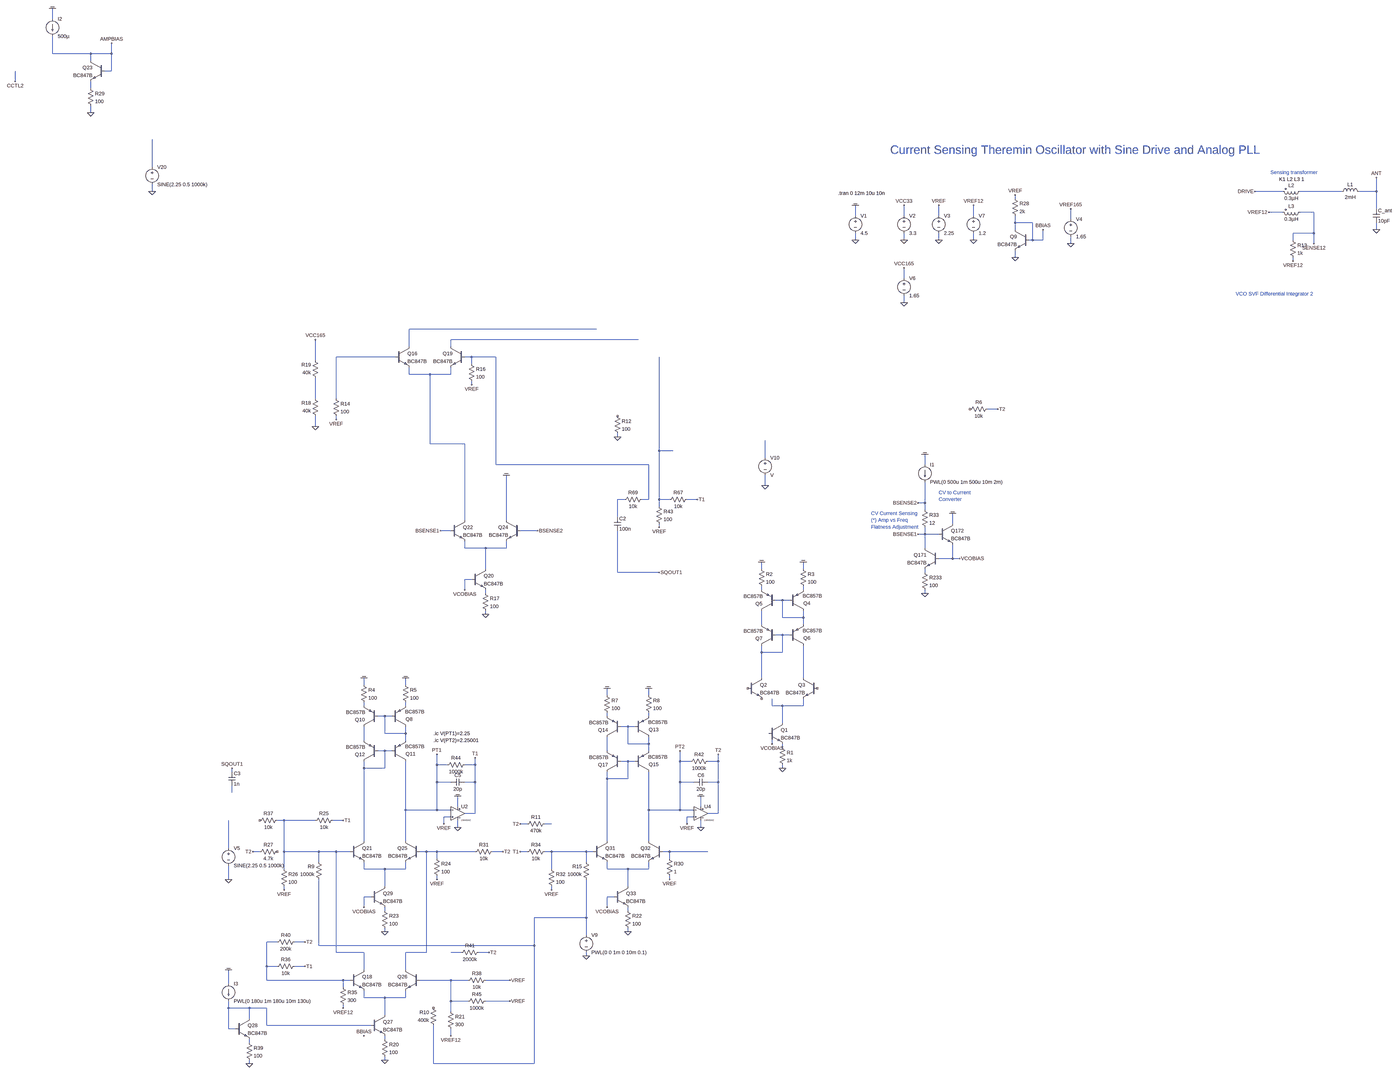
[diagram p0: schematic theremin_oscillator_bjt_v02.asc, whole sheet]
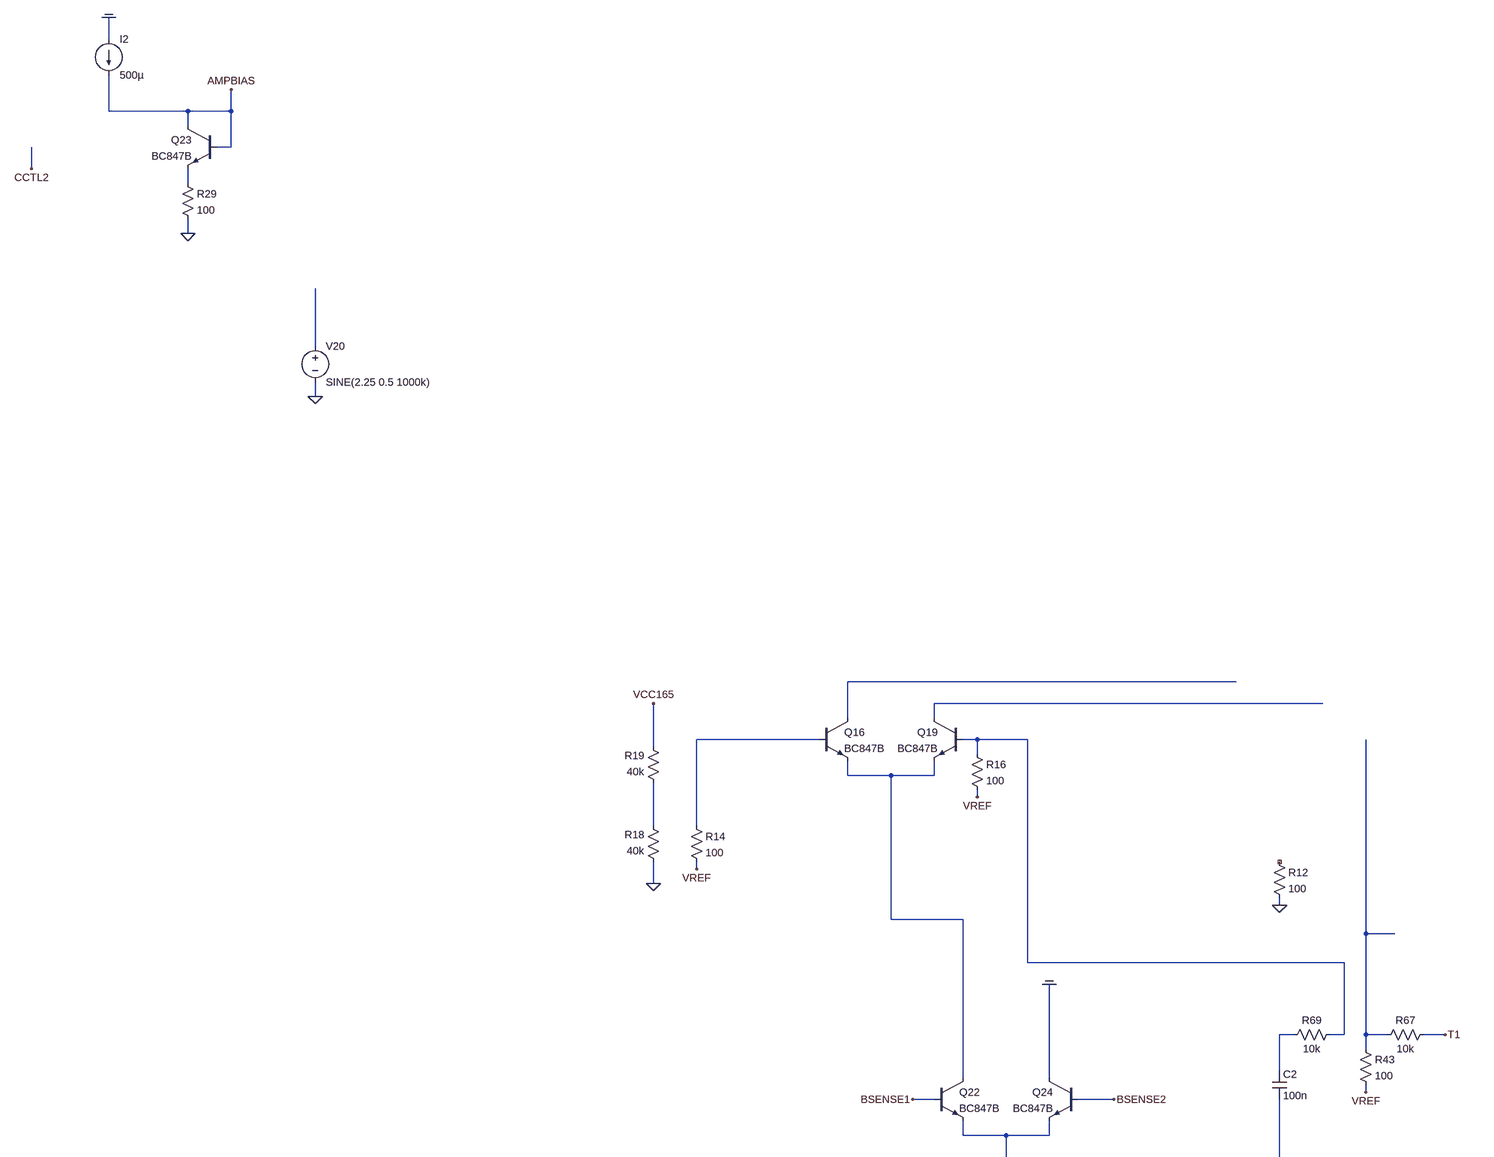
[diagram p1: schematic theremin_oscillator_bjt_v02.asc, part, row 1 of 2, column 1 of 2]
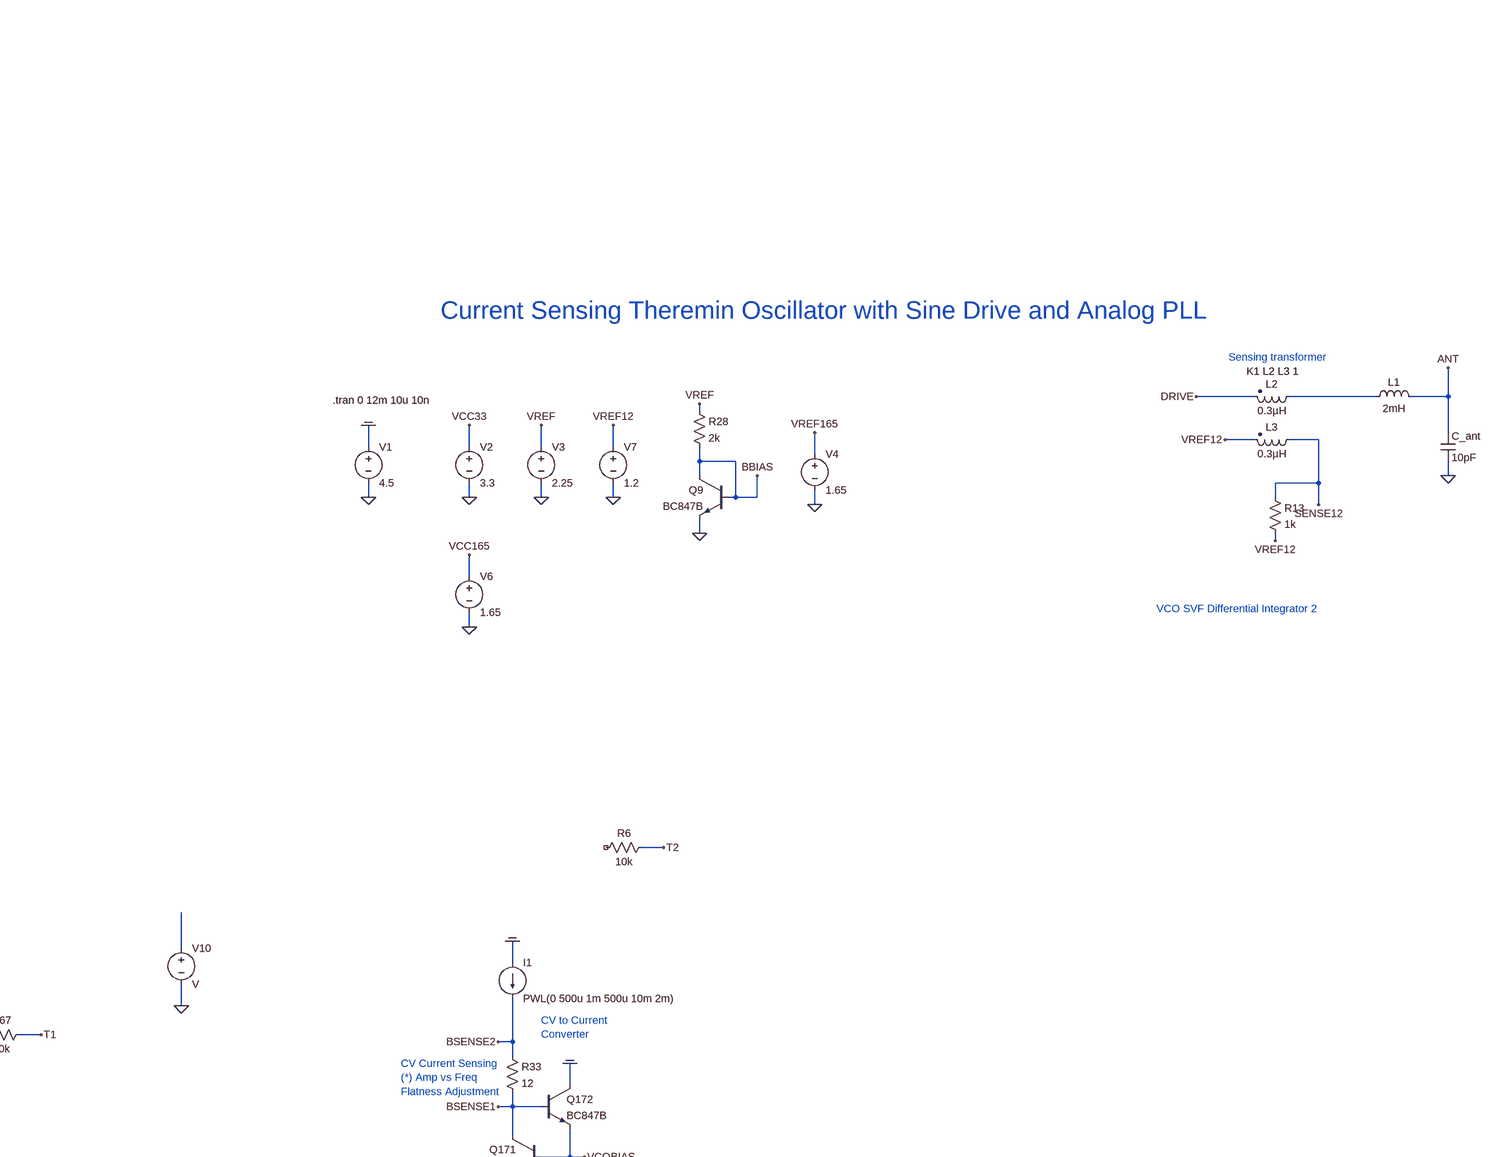
[diagram p2: schematic theremin_oscillator_bjt_v02.asc, part, row 1 of 2, column 2 of 2]
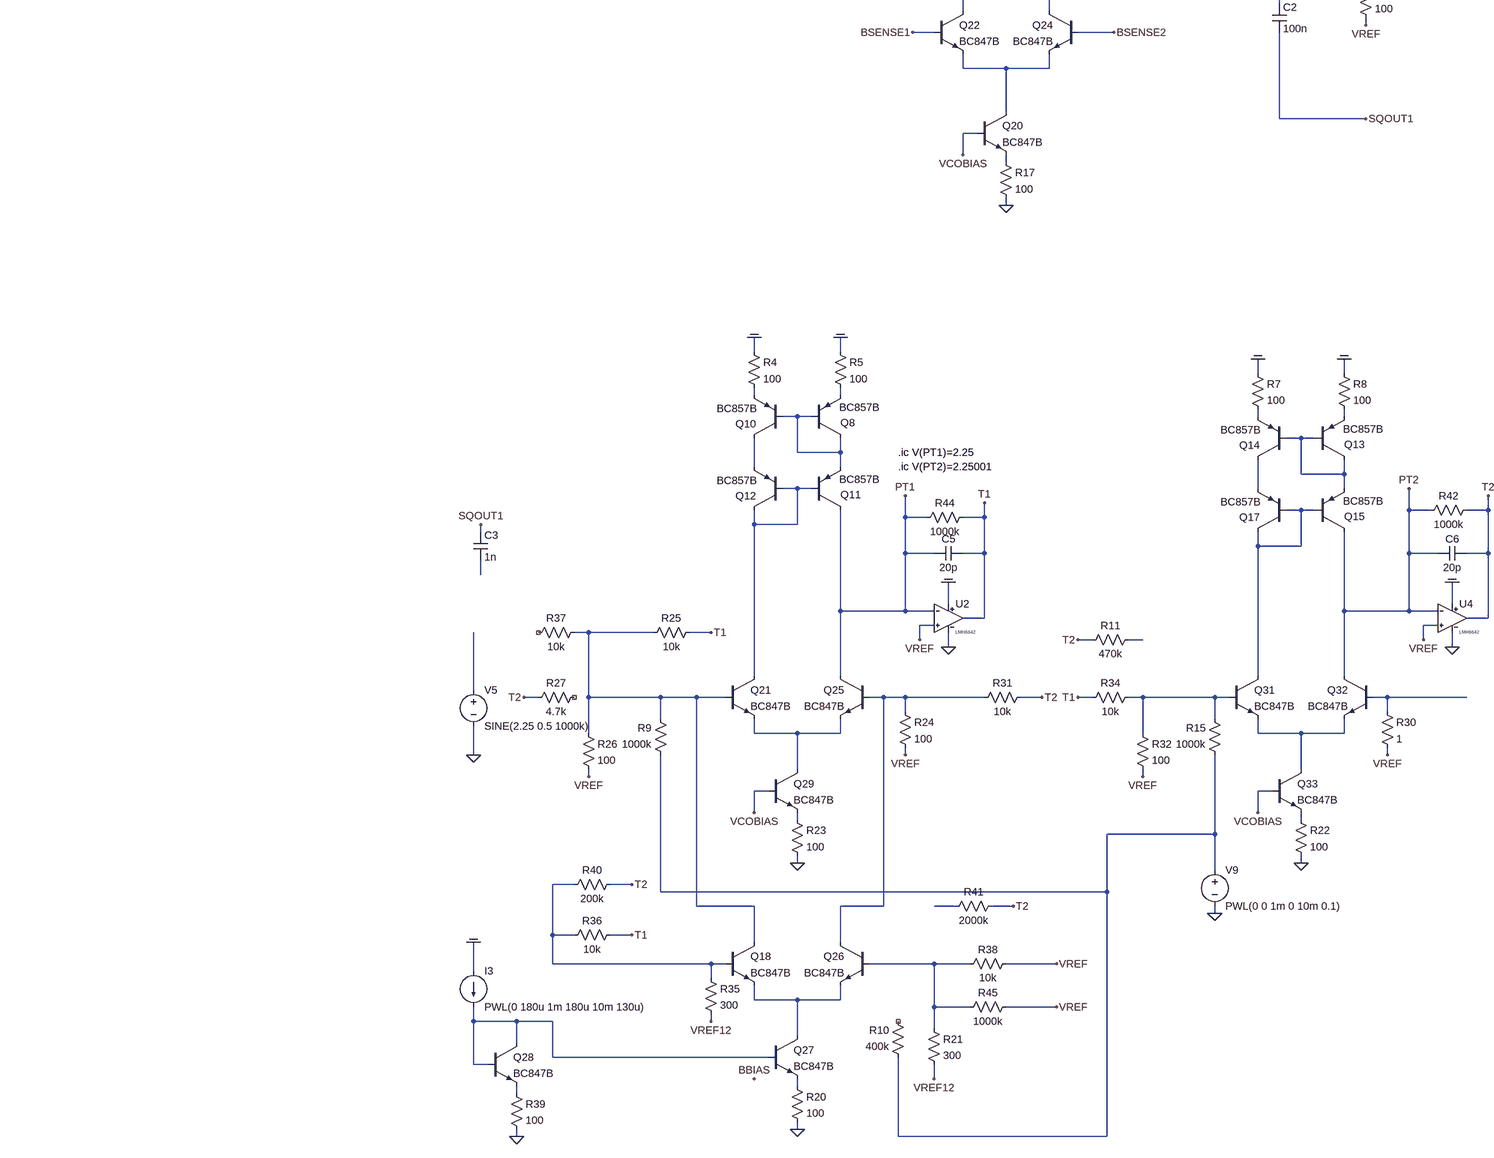
[diagram p3: schematic theremin_oscillator_bjt_v02.asc, part, row 2 of 2, column 1 of 2]
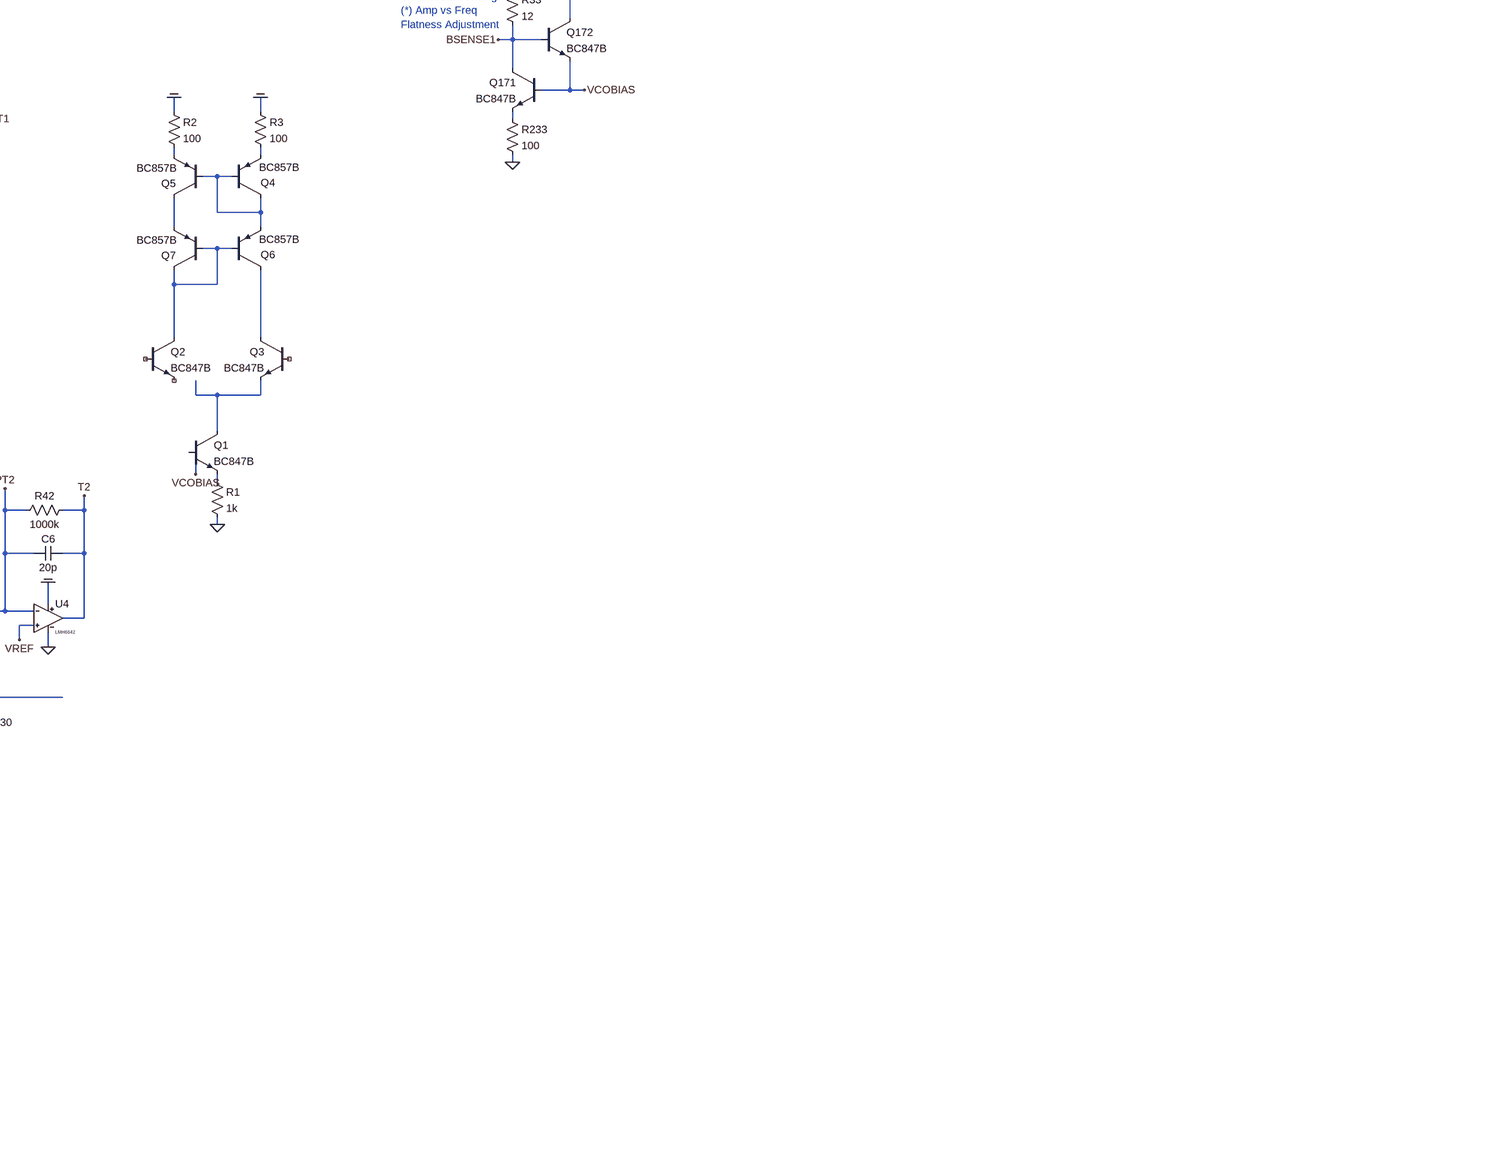
[diagram p4: schematic theremin_oscillator_bjt_v02.asc, part, row 2 of 2, column 2 of 2]
theremin_oscillator_bjt_v02.asc, the LTspice schematic file:
Version 4
SHEET 1 17540 12720
WIRE -192 2960 -192 2912
WIRE -192 3120 -192 3040
WIRE -16 3120 -192 3120
WIRE 80 3120 80 3072
WIRE 80 3120 -16 3120
WIRE -16 3152 -16 3120
WIRE 80 3200 80 3120
WIRE 80 3200 48 3200
WIRE -432 3248 -432 3200
WIRE -16 3280 -16 3248
WIRE -16 3392 -16 3360
WIRE 592 3664 592 3536
WIRE 592 3776 592 3744
WIRE 5840 3776 5712 3776
WIRE 6112 3776 5920 3776
WIRE 6272 3776 6272 3712
WIRE 6272 3776 6192 3776
WIRE 4608 3808 4608 3792
WIRE 6272 3856 6272 3776
WIRE 5840 3872 5776 3872
WIRE 5984 3872 5920 3872
WIRE 3872 3888 3872 3840
WIRE 4096 3888 4096 3840
WIRE 4256 3888 4256 3840
WIRE 4416 3888 4416 3840
WIRE 4864 3904 4864 3856
WIRE 4608 3920 4608 3888
WIRE 4688 3920 4608 3920
WIRE 4608 3952 4608 3920
WIRE 6272 3952 6272 3920
WIRE 5984 3968 5984 3872
WIRE 5984 3968 5888 3968
WIRE 3872 4000 3872 3968
WIRE 4096 4000 4096 3968
WIRE 4256 4000 4256 3968
WIRE 4416 4000 4416 3968
WIRE 4688 4000 4688 3920
WIRE 4688 4000 4672 4000
WIRE 4736 4000 4736 3952
WIRE 4736 4000 4688 4000
WIRE 5888 4000 5888 3968
WIRE 4864 4016 4864 3984
WIRE 5984 4016 5984 3968
WIRE 4608 4080 4608 4048
WIRE 5888 4096 5888 4080
WIRE 4096 4176 4096 4128
WIRE 4096 4288 4096 4256
WIRE 2640 5152 1776 5152
WIRE 2832 5200 1968 5200
WIRE 1776 5232 1776 5152
WIRE 1968 5232 1968 5200
WIRE 1712 5280 1440 5280
WIRE 2064 5280 2032 5280
WIRE 2176 5280 2064 5280
WIRE 1344 5296 1344 5200
WIRE 2064 5312 2064 5280
WIRE 1776 5360 1776 5328
WIRE 1872 5360 1776 5360
WIRE 1968 5360 1968 5328
WIRE 1968 5360 1872 5360
WIRE 2064 5408 2064 5392
WIRE 1344 5472 1344 5376
WIRE 1440 5472 1440 5280
WIRE 4528 5520 4480 5520
WIRE 1440 5568 1440 5552
WIRE 1344 5600 1344 5552
WIRE 2736 5648 2736 5632
WIRE 1872 5680 1872 5360
WIRE 2032 5680 1872 5680
WIRE 2928 5712 2928 5280
WIRE 2992 5712 2928 5712
WIRE 3456 5744 3456 5664
WIRE 2176 5776 2176 5280
WIRE 2880 5776 2176 5776
WIRE 4192 5776 4192 5728
WIRE 3456 5872 3456 5824
WIRE 2768 5936 2736 5936
WIRE 2880 5936 2880 5776
WIRE 2880 5936 2848 5936
WIRE 2928 5936 2928 5712
WIRE 2976 5936 2928 5936
WIRE 3104 5936 3056 5936
WIRE 4192 5952 4192 5856
WIRE 4192 5952 4160 5952
WIRE 2928 5968 2928 5936
WIRE 4192 5984 4192 5952
WIRE 2736 6016 2736 5936
WIRE 2032 6032 2032 5680
WIRE 2224 6032 2224 5824
WIRE 4320 6048 4320 6000
WIRE 2928 6064 2928 6048
WIRE 1968 6080 1920 6080
WIRE 2368 6080 2288 6080
WIRE 4192 6096 4192 6064
WIRE 4192 6096 4160 6096
WIRE 4256 6096 4192 6096
WIRE 2032 6160 2032 6128
WIRE 2128 6160 2032 6160
WIRE 2224 6160 2224 6128
WIRE 2224 6160 2128 6160
WIRE 4192 6160 4192 6096
WIRE 4320 6208 4320 6144
WIRE 4320 6208 4256 6208
WIRE 4352 6208 4320 6208
WIRE 2128 6256 2128 6160
WIRE 3440 6256 3440 6224
WIRE 3632 6256 3632 6224
WIRE 2736 6272 2736 6080
WIRE 2928 6272 2736 6272
WIRE 4192 6272 4192 6256
WIRE 2064 6304 2032 6304
WIRE 2032 6352 2032 6304
WIRE 3440 6352 3440 6336
WIRE 3632 6352 3632 6336
WIRE 2128 6368 2128 6352
WIRE 4192 6368 4192 6352
WIRE 3536 6400 3504 6400
WIRE 3568 6400 3536 6400
WIRE 2128 6464 2128 6448
WIRE 3536 6480 3536 6400
WIRE 3632 6480 3632 6448
WIRE 3632 6480 3536 6480
WIRE 3440 6512 3440 6448
WIRE 3632 6512 3632 6480
WIRE 3536 6560 3504 6560
WIRE 3568 6560 3536 6560
WIRE 3440 6640 3440 6608
WIRE 3536 6640 3536 6560
WIRE 3536 6640 3440 6640
WIRE 3440 6816 3440 6640
WIRE 3632 6816 3632 6608
WIRE 1568 6848 1568 6816
WIRE 1760 6848 1760 6816
WIRE 2688 6896 2688 6864
WIRE 2880 6896 2880 6864
WIRE 1568 6944 1568 6928
WIRE 1760 6944 1760 6928
WIRE 3488 6944 3488 6912
WIRE 3536 6944 3488 6944
WIRE 3632 6944 3632 6912
WIRE 3632 6944 3536 6944
WIRE 1664 6992 1632 6992
WIRE 1696 6992 1664 6992
WIRE 2688 6992 2688 6976
WIRE 2880 6992 2880 6976
WIRE 3536 7024 3536 6944
WIRE 2784 7040 2752 7040
WIRE 2816 7040 2784 7040
WIRE 1664 7072 1664 6992
WIRE 1760 7072 1760 7040
WIRE 1760 7072 1664 7072
WIRE 3488 7072 3472 7072
WIRE 1568 7104 1568 7040
WIRE 1760 7104 1760 7072
WIRE 2784 7120 2784 7040
WIRE 2880 7120 2880 7088
WIRE 2880 7120 2784 7120
WIRE 3488 7120 3488 7072
WIRE 3536 7136 3536 7120
WIRE 1664 7152 1632 7152
WIRE 1696 7152 1664 7152
WIRE 2688 7152 2688 7088
WIRE 2880 7152 2880 7120
WIRE 2784 7200 2752 7200
WIRE 2816 7200 2784 7200
WIRE 3024 7200 3024 7152
WIRE 3072 7200 3024 7200
WIRE 3200 7200 3200 7168
WIRE 3200 7200 3152 7200
WIRE 1904 7216 1904 7168
WIRE 1952 7216 1904 7216
WIRE 2080 7216 2080 7184
WIRE 2080 7216 2032 7216
WIRE 1568 7232 1568 7200
WIRE 1664 7232 1664 7152
WIRE 1664 7232 1568 7232
WIRE 3536 7232 3536 7216
WIRE 960 7248 960 7232
WIRE 2688 7280 2688 7248
WIRE 2784 7280 2784 7200
WIRE 2784 7280 2688 7280
WIRE 1904 7296 1904 7216
WIRE 1968 7296 1904 7296
WIRE 2080 7296 2080 7216
WIRE 2080 7296 2032 7296
WIRE 3024 7296 3024 7200
WIRE 3088 7296 3024 7296
WIRE 3200 7296 3200 7200
WIRE 3200 7296 3152 7296
WIRE 960 7344 960 7312
WIRE 2000 7408 2000 7360
WIRE 3120 7408 3120 7360
WIRE 1760 7424 1760 7200
WIRE 1904 7424 1904 7296
WIRE 1904 7424 1760 7424
WIRE 1968 7424 1904 7424
WIRE 2880 7424 2880 7248
WIRE 3024 7424 3024 7296
WIRE 3024 7424 2880 7424
WIRE 3088 7424 3024 7424
WIRE 2080 7440 2080 7296
WIRE 2080 7440 2032 7440
WIRE 3200 7440 3200 7296
WIRE 3200 7440 3152 7440
WIRE 1968 7456 1936 7456
WIRE 3088 7456 3056 7456
WIRE 1200 7472 1168 7472
WIRE 1344 7472 1200 7472
WIRE 1472 7472 1424 7472
WIRE 1936 7488 1936 7456
WIRE 2320 7488 2288 7488
WIRE 2432 7488 2400 7488
WIRE 3056 7488 3056 7456
WIRE 2000 7504 2000 7472
WIRE 3120 7504 3120 7472
WIRE 1568 7568 1568 7232
WIRE 1760 7568 1760 7424
WIRE 2688 7568 2688 7280
WIRE 2880 7568 2880 7424
WIRE 944 7600 944 7472
WIRE 1088 7616 1056 7616
WIRE 1200 7616 1200 7472
WIRE 1360 7616 1200 7616
WIRE 1440 7616 1360 7616
WIRE 1504 7616 1440 7616
WIRE 1856 7616 1824 7616
WIRE 1904 7616 1856 7616
WIRE 2080 7616 1904 7616
WIRE 2208 7616 2160 7616
WIRE 2320 7616 2288 7616
WIRE 2432 7616 2400 7616
WIRE 2592 7616 2432 7616
WIRE 2624 7616 2592 7616
WIRE 2976 7616 2944 7616
WIRE 3152 7616 2976 7616
WIRE 1904 7648 1904 7616
WIRE 2976 7648 2976 7616
WIRE 1360 7664 1360 7616
WIRE 2592 7664 2592 7616
WIRE 1200 7696 1200 7616
WIRE 1568 7696 1568 7664
WIRE 1664 7696 1568 7696
WIRE 1760 7696 1760 7664
WIRE 1760 7696 1664 7696
WIRE 2432 7696 2432 7616
WIRE 2688 7696 2688 7664
WIRE 2784 7696 2688 7696
WIRE 2880 7696 2880 7664
WIRE 2880 7696 2784 7696
WIRE 944 7744 944 7680
WIRE 1904 7744 1904 7728
WIRE 2976 7744 2976 7728
WIRE 1664 7776 1664 7696
WIRE 2784 7776 2784 7696
WIRE 1200 7792 1200 7776
WIRE 2432 7792 2432 7776
WIRE 1600 7824 1568 7824
WIRE 2720 7824 2688 7824
WIRE 1568 7872 1568 7824
WIRE 2688 7872 2688 7824
WIRE 1664 7888 1664 7872
WIRE 2784 7888 2784 7872
WIRE 2592 7920 2592 7744
WIRE 2592 7920 2352 7920
WIRE 1664 7984 1664 7968
WIRE 2784 7984 2784 7968
WIRE 2592 8000 2592 7920
WIRE 1168 8032 1120 8032
WIRE 1296 8032 1248 8032
WIRE 1360 8048 1360 7744
WIRE 2352 8048 2352 7920
WIRE 2352 8048 1360 8048
WIRE 1440 8080 1440 7616
WIRE 1568 8080 1440 8080
WIRE 1856 8080 1856 7616
WIRE 1856 8080 1760 8080
WIRE 2016 8080 1968 8080
WIRE 2144 8080 2096 8080
WIRE 2592 8096 2592 8080
WIRE 1120 8144 1120 8032
WIRE 1168 8144 1120 8144
WIRE 1296 8144 1248 8144
WIRE 1568 8160 1568 8080
WIRE 1760 8160 1760 8080
WIRE 1120 8208 1120 8144
WIRE 1472 8208 1120 8208
WIRE 1504 8208 1472 8208
WIRE 1968 8208 1824 8208
WIRE 2048 8208 1968 8208
WIRE 2240 8208 2128 8208
WIRE 944 8224 944 8160
WIRE 1472 8240 1472 8208
WIRE 1568 8288 1568 8256
WIRE 1664 8288 1568 8288
WIRE 1760 8288 1760 8256
WIRE 1760 8288 1664 8288
WIRE 1968 8304 1968 8208
WIRE 2048 8304 1968 8304
WIRE 2240 8304 2128 8304
WIRE 944 8336 944 8304
WIRE 1040 8336 944 8336
WIRE 1120 8336 1040 8336
WIRE 1472 8336 1472 8320
WIRE 1968 8352 1968 8304
WIRE 1664 8368 1664 8288
WIRE 1040 8384 1040 8336
WIRE 1120 8416 1120 8336
WIRE 1600 8416 1120 8416
WIRE 944 8432 944 8336
WIRE 976 8432 944 8432
WIRE 1968 8464 1968 8432
WIRE 1664 8480 1664 8464
WIRE 1040 8496 1040 8480
WIRE 1664 8576 1664 8560
WIRE 1040 8592 1040 8576
WIRE 1888 8592 1888 8416
WIRE 2352 8592 2352 8048
WIRE 2352 8592 1888 8592
FLAG 3872 4000 0
FLAG 3872 3840 COM
FLAG 4096 4000 0
FLAG 4096 3840 VCC33
FLAG 4256 4000 0
FLAG 4256 3840 VREF
FLAG 6272 3712 ANT
FLAG 6272 3952 0
FLAG 5712 3776 DRIVE
FLAG 4416 4000 0
FLAG 4416 3840 VREF12
FLAG 5776 3872 VREF12
FLAG 5984 4016 SENSE12
FLAG 5888 4096 VREF12
FLAG -432 3248 CCTL2
FLAG 592 3776 0
FLAG 4192 6368 0
FLAG 4320 6000 COM
FLAG 4352 6208 VCOBIAS
FLAG -16 3392 0
FLAG -192 2912 COM
FLAG 80 3072 AMPBIAS
FLAG 4160 6096 BSENSE1
FLAG 4160 5952 BSENSE2
FLAG 4608 4080 0
FLAG 4736 3952 BBIAS
FLAG 4608 3792 VREF
FLAG 4864 4016 0
FLAG 4864 3856 VREF165
FLAG 2928 6064 VREF
FLAG 3104 5936 T1
FLAG 4192 5728 COM
FLAG 3536 7232 0
FLAG 3488 7120 VCOBIAS
FLAG 3440 6224 COM
FLAG 3632 6224 COM
FLAG 4096 4288 0
FLAG 4096 4128 VCC165
FLAG 4528 5520 T2
FLAG 2928 6272 SQOUT1
FLAG 1440 5568 VREF
FLAG 2064 5408 VREF
FLAG 2128 6464 0
FLAG 2032 6352 VCOBIAS
FLAG 1920 6080 BSENSE1
FLAG 2368 6080 BSENSE2
FLAG 2736 5648 0
FLAG 2224 5824 COM
FLAG 1344 5200 VCC165
FLAG 1344 5600 0
FLAG 1664 7984 0
FLAG 1568 7872 VCOBIAS
FLAG 2000 7504 0
FLAG 2000 7360 COM
FLAG 1936 7488 VREF
FLAG 1904 7744 VREF
FLAG 1472 7472 T1
FLAG 1200 7792 VREF
FLAG 1056 7616 T2
FLAG 2784 7984 0
FLAG 2688 7872 VCOBIAS
FLAG 3120 7504 0
FLAG 3120 7360 COM
FLAG 3056 7488 VREF
FLAG 2976 7744 VREF
FLAG 2432 7792 VREF
FLAG 2288 7616 T1
FLAG 944 7744 0
FLAG 2080 7184 T1
FLAG 3200 7168 T2
FLAG 2208 7616 T2
FLAG 960 7232 SQOUT1
FLAG 1664 8576 0
FLAG 1568 8464 BBIAS
FLAG 1968 8464 VREF12
FLAG 1472 8336 VREF12
FLAG 1296 8144 T1
FLAG 1040 8592 0
FLAG 944 8160 COM
FLAG 2240 8208 VREF
FLAG 1904 7168 PT1
FLAG 3024 7152 PT2
FLAG 2592 8096 0
FLAG 3456 5872 0
FLAG 2288 7488 T2
FLAG 1296 8032 T2
FLAG 2144 8080 T2
FLAG 1568 6816 COM
FLAG 1760 6816 COM
FLAG 2688 6864 COM
FLAG 2880 6864 COM
FLAG 2240 8304 VREF
SYMBOL voltage 3872 3872 R0
SYMATTR InstName V1
SYMATTR Value 4.5
SYMBOL voltage 4096 3872 R0
SYMATTR InstName V2
SYMATTR Value 3.3
SYMBOL voltage 4256 3872 R0
SYMATTR InstName V3
SYMATTR Value 2.25
SYMBOL ind 6096 3792 R270
WINDOW 0 32 56 VTop 2
WINDOW 3 5 56 VBottom 2
SYMATTR InstName L1
SYMATTR Value 2mH
SYMATTR SpiceLine Rser=120 Cpar=1pF
SYMBOL Cap 6256 3856 R0
SYMATTR InstName C_ant
SYMATTR Value 10pF
SYMBOL voltage 4416 3872 R0
SYMATTR InstName V7
SYMATTR Value 1.2
SYMBOL ind2 5936 3760 R90
WINDOW 0 4 56 VBottom 2
WINDOW 3 32 56 VTop 2
SYMATTR InstName L2
SYMATTR Value 0.3µH
SYMATTR SpiceLine Rser=0.1 Cpar=0.1p
SYMBOL ind2 5936 3856 R90
WINDOW 0 4 56 VBottom 2
WINDOW 3 32 56 VTop 2
SYMATTR InstName L3
SYMATTR Value 0.3µH
SYMATTR SpiceLine Rser=0.1 Cpar=0.1p
SYMBOL Res 5872 3984 R0
SYMATTR InstName R13
SYMATTR Value 1k
SYMBOL Voltage 592 3648 R0
SYMATTR InstName V20
SYMATTR Value SINE(2.25 0.5 1000k)
SYMBOL Res 4176 6256 R0
SYMATTR InstName R233
SYMATTR Value 100
SYMBOL npn 4256 6160 M0
SYMATTR InstName Q171
SYMATTR Value BC847B
SYMBOL npn 4256 6048 R0
SYMATTR InstName Q172
SYMATTR Value BC847B
SYMBOL npn 48 3152 M0
SYMATTR InstName Q23
SYMATTR Value BC847B
SYMBOL Res -32 3264 R0
SYMATTR InstName R29
SYMATTR Value 100
SYMBOL current -192 2960 R0
SYMATTR InstName I2
SYMATTR Value 500µ
SYMBOL Res 4176 5968 R0
SYMATTR InstName R33
SYMATTR Value 12
SYMBOL npn 4672 3952 M0
SYMATTR InstName Q9
SYMATTR Value BC847B
SYMBOL Res 4592 3792 R0
SYMATTR InstName R28
SYMATTR Value 2k
SYMBOL voltage 4864 3888 R0
SYMATTR InstName V4
SYMATTR Value 1.65
SYMBOL Res 2912 5952 R0
SYMATTR InstName R43
SYMATTR Value 100
SYMBOL Res 3072 5920 R90
WINDOW 0 0 56 VBottom 2
WINDOW 3 32 56 VTop 2
SYMATTR InstName R67
SYMATTR Value 10k
SYMBOL Res 2864 5920 R90
WINDOW 0 0 56 VBottom 2
WINDOW 3 32 56 VTop 2
SYMATTR InstName R69
SYMATTR Value 10k
SYMBOL current 4192 5776 R0
SYMATTR InstName I1
SYMATTR Value PWL(0 500u 1m 500u 10m 2m)
SYMBOL Res 3520 7120 R0
SYMATTR InstName R1
SYMATTR Value 1k
SYMBOL npn 3472 7024 R0
SYMATTR InstName Q1
SYMATTR Value BC847B
SYMBOL npn 3376 6816 R0
SYMATTR InstName Q2
SYMATTR Value BC847B
SYMBOL npn 3696 6816 M0
SYMATTR InstName Q3
SYMATTR Value BC847B
SYMBOL pnp 3568 6448 M180
WINDOW 0 64 34 Left 2
WINDOW 3 61 68 Left 2
SYMATTR InstName Q4
SYMATTR Value BC857B
SYMBOL pnp 3504 6448 R180
WINDOW 0 60 32 Left 2
WINDOW 3 58 66 Left 2
SYMATTR InstName Q5
SYMATTR Value BC857B
SYMBOL Res 3424 6240 R0
SYMATTR InstName R2
SYMATTR Value 100
SYMBOL Res 3616 6240 R0
SYMATTR InstName R3
SYMATTR Value 100
SYMBOL pnp 3568 6608 M180
WINDOW 0 64 34 Left 2
WINDOW 3 61 68 Left 2
SYMATTR InstName Q6
SYMATTR Value BC857B
SYMBOL pnp 3504 6608 R180
WINDOW 0 60 32 Left 2
WINDOW 3 58 66 Left 2
SYMATTR InstName Q7
SYMATTR Value BC857B
SYMBOL voltage 4096 4160 R0
SYMATTR InstName V6
SYMATTR Value 1.65
SYMBOL Res 4496 5504 R90
WINDOW 0 0 56 VBottom 2
WINDOW 3 32 56 VTop 2
SYMATTR InstName R6
SYMATTR Value 10k
SYMBOL npn 1712 5232 R0
SYMATTR InstName Q16
SYMATTR Value BC847B
SYMBOL npn 2032 5232 M0
SYMATTR InstName Q19
SYMATTR Value BC847B
SYMBOL Res 1424 5456 R0
SYMATTR InstName R14
SYMATTR Value 100
SYMBOL Res 2048 5296 R0
SYMATTR InstName R16
SYMATTR Value 100
SYMBOL Res 2112 6352 R0
SYMATTR InstName R17
SYMATTR Value 100
SYMBOL npn 2064 6256 R0
SYMATTR InstName Q20
SYMATTR Value BC847B
SYMBOL npn 1968 6032 R0
SYMATTR InstName Q22
SYMATTR Value BC847B
SYMBOL npn 2288 6032 M0
SYMATTR InstName Q24
SYMATTR Value BC847B
SYMBOL Res 2720 5536 R0
SYMATTR InstName R12
SYMATTR Value 100
SYMBOL Res 1360 5568 R180
WINDOW 0 36 76 Left 2
WINDOW 3 36 40 Left 2
SYMATTR InstName R18
SYMATTR Value 40k
SYMBOL Res 1360 5392 R180
WINDOW 0 36 76 Left 2
WINDOW 3 36 40 Left 2
SYMATTR InstName R19
SYMATTR Value 40k
SYMBOL Cap 2720 6016 R0
SYMATTR InstName C2
SYMATTR Value 100n
SYMBOL npn 1504 7568 R0
SYMATTR InstName Q21
SYMATTR Value BC847B
SYMBOL npn 1824 7568 M0
SYMATTR InstName Q25
SYMATTR Value BC847B
SYMBOL Res 1648 7872 R0
SYMATTR InstName R23
SYMATTR Value 100
SYMBOL npn 1600 7776 R0
SYMATTR InstName Q29
SYMATTR Value BC847B
SYMBOL Cap 2032 7280 R90
WINDOW 0 0 32 VBottom 2
WINDOW 3 32 32 VTop 2
SYMATTR InstName C5
SYMATTR Value 20p
SYMBOL Res 1888 7632 R0
SYMATTR InstName R24
SYMATTR Value 100
SYMBOL Res 1440 7456 R90
WINDOW 0 0 56 VBottom 2
WINDOW 3 32 56 VTop 2
SYMATTR InstName R25
SYMATTR Value 10k
SYMBOL Res 1184 7680 R0
SYMATTR InstName R26
SYMATTR Value 100
SYMBOL Res 1184 7600 R90
WINDOW 0 0 56 VBottom 2
WINDOW 3 32 56 VTop 2
SYMATTR InstName R27
SYMATTR Value 4.7k
SYMBOL npn 2624 7568 R0
SYMATTR InstName Q31
SYMATTR Value BC847B
SYMBOL npn 2944 7568 M0
SYMATTR InstName Q32
SYMATTR Value BC847B
SYMBOL Res 2768 7872 R0
SYMATTR InstName R22
SYMATTR Value 100
SYMBOL npn 2720 7776 R0
SYMATTR InstName Q33
SYMATTR Value BC847B
SYMBOL Cap 3152 7280 R90
WINDOW 0 0 32 VBottom 2
WINDOW 3 32 32 VTop 2
SYMATTR InstName C6
SYMATTR Value 20p
SYMBOL Res 2960 7632 R0
SYMATTR InstName R30
SYMATTR Value 1
SYMBOL Res 2416 7680 R0
SYMATTR InstName R32
SYMATTR Value 100
SYMBOL Res 2416 7600 R90
WINDOW 0 0 56 VBottom 2
WINDOW 3 32 56 VTop 2
SYMATTR InstName R34
SYMATTR Value 10k
SYMBOL Voltage 944 7584 R0
SYMATTR InstName V5
SYMATTR Value SINE(2.25 0.5 1000k)
SYMBOL Res 1184 7456 R90
WINDOW 0 0 56 VBottom 2
WINDOW 3 32 56 VTop 2
SYMATTR InstName R37
SYMATTR Value 10k
SYMBOL Res 2176 7600 R90
WINDOW 0 0 56 VBottom 2
WINDOW 3 32 56 VTop 2
SYMATTR InstName R31
SYMATTR Value 10k
SYMBOL Cap 944 7248 R0
SYMATTR InstName C3
SYMATTR Value 1n
SYMBOL LMH6642 3120 7376 R0
WINDOW 0 16 32 Left 2
SYMATTR InstName U4
SYMBOL LMH6642 2000 7376 R0
WINDOW 0 16 32 Left 2
SYMATTR InstName U2
SYMBOL Res 1376 7760 R180
WINDOW 0 36 76 Left 2
WINDOW 3 36 40 Left 2
SYMATTR InstName R9
SYMATTR Value 1000k
SYMBOL Res 2608 7760 R180
WINDOW 0 36 76 Left 2
WINDOW 3 36 40 Left 2
SYMATTR InstName R15
SYMATTR Value 1000k
SYMBOL npn 1504 8160 R0
SYMATTR InstName Q18
SYMATTR Value BC847B
SYMBOL npn 1824 8160 M0
SYMATTR InstName Q26
SYMATTR Value BC847B
SYMBOL Res 1648 8464 R0
SYMATTR InstName R20
SYMATTR Value 100
SYMBOL npn 1600 8368 R0
SYMATTR InstName Q27
SYMATTR Value BC847B
SYMBOL Res 1952 8336 R0
SYMATTR InstName R21
SYMATTR Value 300
SYMBOL Res 1456 8224 R0
SYMATTR InstName R35
SYMATTR Value 300
SYMBOL Res 1264 8128 R90
WINDOW 0 0 56 VBottom 2
WINDOW 3 32 56 VTop 2
SYMATTR InstName R36
SYMATTR Value 10k
SYMBOL Res 2144 8192 R90
WINDOW 0 0 56 VBottom 2
WINDOW 3 32 56 VTop 2
SYMATTR InstName R38
SYMATTR Value 10k
SYMBOL Res 1024 8480 R0
SYMATTR InstName R39
SYMATTR Value 100
SYMBOL npn 976 8384 R0
SYMATTR InstName Q28
SYMATTR Value BC847B
SYMBOL current 944 8224 R0
SYMATTR InstName I3
SYMATTR Value PWL(0 180u 1m 180u 10m 130u)
SYMBOL Voltage 2592 7984 R0
SYMATTR InstName V9
SYMATTR Value PWL(0 0 1m 0 10m 0.1)
SYMBOL Voltage 3456 5728 R0
SYMATTR InstName V10
SYMBOL Res 2416 7472 R90
WINDOW 0 0 56 VBottom 2
WINDOW 3 32 56 VTop 2
SYMATTR InstName R11
SYMATTR Value 470k
SYMBOL Res 1264 8016 R90
WINDOW 0 0 56 VBottom 2
WINDOW 3 32 56 VTop 2
SYMATTR InstName R40
SYMATTR Value 200k
SYMBOL Res 2112 8064 R90
WINDOW 0 0 56 VBottom 2
WINDOW 3 32 56 VTop 2
SYMATTR InstName R41
SYMATTR Value 2000k
SYMBOL Res 1904 8432 R180
WINDOW 0 36 76 Left 2
WINDOW 3 36 40 Left 2
SYMATTR InstName R10
SYMATTR Value 400k
SYMBOL Res 3168 7184 R90
WINDOW 0 0 56 VBottom 2
WINDOW 3 32 56 VTop 2
SYMATTR InstName R42
SYMATTR Value 1000k
SYMBOL Res 2048 7200 R90
WINDOW 0 0 56 VBottom 2
WINDOW 3 32 56 VTop 2
SYMATTR InstName R44
SYMATTR Value 1000k
SYMBOL pnp 1696 7040 M180
WINDOW 0 64 34 Left 2
WINDOW 3 61 68 Left 2
SYMATTR InstName Q8
SYMATTR Value BC857B
SYMBOL pnp 1632 7040 R180
WINDOW 0 60 32 Left 2
WINDOW 3 58 66 Left 2
SYMATTR InstName Q10
SYMATTR Value BC857B
SYMBOL Res 1552 6832 R0
SYMATTR InstName R4
SYMATTR Value 100
SYMBOL Res 1744 6832 R0
SYMATTR InstName R5
SYMATTR Value 100
SYMBOL pnp 1696 7200 M180
WINDOW 0 64 34 Left 2
WINDOW 3 61 68 Left 2
SYMATTR InstName Q11
SYMATTR Value BC857B
SYMBOL pnp 1632 7200 R180
WINDOW 0 60 32 Left 2
WINDOW 3 58 66 Left 2
SYMATTR InstName Q12
SYMATTR Value BC857B
SYMBOL pnp 2816 7088 M180
WINDOW 0 64 34 Left 2
WINDOW 3 61 68 Left 2
SYMATTR InstName Q13
SYMATTR Value BC857B
SYMBOL pnp 2752 7088 R180
WINDOW 0 60 32 Left 2
WINDOW 3 58 66 Left 2
SYMATTR InstName Q14
SYMATTR Value BC857B
SYMBOL Res 2672 6880 R0
SYMATTR InstName R7
SYMATTR Value 100
SYMBOL Res 2864 6880 R0
SYMATTR InstName R8
SYMATTR Value 100
SYMBOL pnp 2816 7248 M180
WINDOW 0 64 34 Left 2
WINDOW 3 61 68 Left 2
SYMATTR InstName Q15
SYMATTR Value BC857B
SYMBOL pnp 2752 7248 R180
WINDOW 0 60 32 Left 2
WINDOW 3 58 66 Left 2
SYMATTR InstName Q17
SYMATTR Value BC857B
SYMBOL Res 2144 8288 R90
WINDOW 0 0 56 VBottom 2
WINDOW 3 32 56 VTop 2
SYMATTR InstName R45
SYMATTR Value 1000k
TEXT 3792 3784 Left 2 !.tran 0 12m 10u 10n
TEXT 4032 3584 Left 5 ;Current Sensing Theremin Oscillator with Sine Drive and Analog PLL
TEXT 5824 3720 Left 2 !K1 L2 L3 1
TEXT 5784 3688 Left 2 ;Sensing transformer
TEXT 5624 4248 Left 2 ;VCO SVF Differential Integrator 2
TEXT 4256 5904 Left 2 ;CV to Current\nConverter
TEXT 3944 6000 Left 2 ;CV Current Sensing\n(*) Amp vs Freq \nFlatness Adjustment
TEXT 1888 7072 Left 2 !.ic V(PT1)=2.25\n.ic V(PT2)=2.25001

The netlist it stands for:
* theremin_oscillator_bjt_v02.asc
V1 COM 0 4.5
V2 VCC33 0 3.3
V3 VREF 0 2.25
L1 N003 ANT 2mH Rser=120 Cpar=1pF
C_ant ANT 0 10pF
V7 VREF12 0 1.2
L2 N003 DRIVE 0.3µH Rser=0.1 Cpar=0.1p
L3 SENSE12 VREF12 0.3µH Rser=0.1 Cpar=0.1p
R13 SENSE12 VREF12 1k
V20 N002 0 SINE(2.25 0.5 1000k)
R233 N014 0 100
Q171 BSENSE1 VCOBIAS N014 0 BC847B
Q172 COM BSENSE1 VCOBIAS 0 BC847B
Q23 AMPBIAS AMPBIAS N001 0 BC847B
R29 N001 0 100
I2 COM AMPBIAS 500µ
R33 BSENSE2 BSENSE1 12
Q9 BBIAS BBIAS 0 0 BC847B
R28 VREF BBIAS 2k
V4 VREF165 0 1.65
R43 N010 VREF 100
R67 T1 N010 10k
R69 N007 N012 10k
I1 COM BSENSE2 PWL(0 500u 1m 500u 10m 2m)
R1 N030 0 1k
Q1 N024 VCOBIAS N030 0 BC847B
Q2 N020 NC_01 NC_02 0 BC847B
Q3 N021 NC_03 N024 0 BC847B
Q4 N018 N018 N016 0 BC857B
Q5 N019 N018 N015 0 BC857B
R2 COM N015 100
R3 COM N016 100
Q6 N021 N020 N018 0 BC857B
Q7 N020 N020 N019 0 BC857B
V6 VCC165 0 1.65
R6 T2 NC_04 10k
Q16 N004 N006 N008 0 BC847B
Q19 N005 N007 N008 0 BC847B
R14 N006 VREF 100
R16 N007 VREF 100
R17 N017 0 100
Q20 N013 VCOBIAS N017 0 BC847B
Q22 N008 BSENSE1 N013 0 BC847B
Q24 COM BSENSE2 N013 0 BC847B
R12 NC_05 0 100
R18 0 N009 40k
R19 N009 VCC165 40k
C2 N012 SQOUT1 100n
Q21 N031 N035 N041 0 BC847B
Q25 PT1 N038 N041 0 BC847B
R23 N043 0 100
Q29 N041 VCOBIAS N043 0 BC847B
C5 T1 PT1 20p
R24 N038 VREF 100
R25 T1 N035 10k
R26 N035 VREF 100
R27 NC_06 T2 4.7k
Q31 N033 N039 N042 0 BC847B
Q32 PT2 N040 N042 0 BC847B
R22 N044 0 100
Q33 N042 VCOBIAS N044 0 BC847B
C6 T2 PT2 20p
R30 N040 VREF 1
R32 N039 VREF 100
R34 N039 T1 10k
V5 N037 0 SINE(2.25 0.5 1000k)
R37 N035 NC_07 10k
R31 T2 N038 10k
C3 SQOUT1 N034 1n
XU4 PT2 VREF COM 0 T2 LMH6642  ; pins In- In+ V+ V- OUT
XU2 PT1 VREF COM 0 T1 LMH6642  ; pins In- In+ V+ V- OUT
R9 N045 N035 1000k
R15 N045 N039 1000k
Q18 N035 N046 N049 0 BC847B
Q26 N038 N048 N049 0 BC847B
R20 N051 0 100
Q27 N049 N050 N051 0 BC847B
R21 N048 VREF12 300
R35 N046 VREF12 300
R36 T1 N046 10k
R38 VREF N048 10k
R39 N052 0 100
Q28 N050 N050 N052 0 BC847B
I3 COM N050 PWL(0 180u 1m 180u 10m 130u)
V9 N045 0 PWL(0 0 1m 0 10m 0.1)
V10 N011 0 V
R11 N036 T2 470k
R40 T2 N046 200k
R41 T2 N047 2000k
R10 N045 NC_08 400k
R42 T2 PT2 1000k
R44 T1 PT1 1000k
Q8 N025 N025 N023 0 BC857B
Q10 N029 N025 N022 0 BC857B
R4 COM N022 100
R5 COM N023 100
Q11 PT1 N031 N025 0 BC857B
Q12 N031 N031 N029 0 BC857B
Q13 N028 N028 N027 0 BC857B
Q14 N032 N028 N026 0 BC857B
R7 COM N026 100
R8 COM N027 100
Q15 PT2 N033 N028 0 BC857B
Q17 N033 N033 N032 0 BC857B
R45 VREF N048 1000k
.model NPN NPN
.model PNP PNP
.lib standard.bjt
.tran 0 12m 10u 10n
* Current Sensing Theremin Oscillator with Sine Drive and Analog PLL
K1 L2 L3 1
* Sensing transformer
* VCO SVF Differential Integrator 2
* CV to Current
* Converter
* CV Current Sensing
* (*) Amp vs Freq
* Flatness Adjustment
.ic V(PT1)=2.25
.ic V(PT2)=2.25001
.lib LMH6642.MOD
.backanno
.end